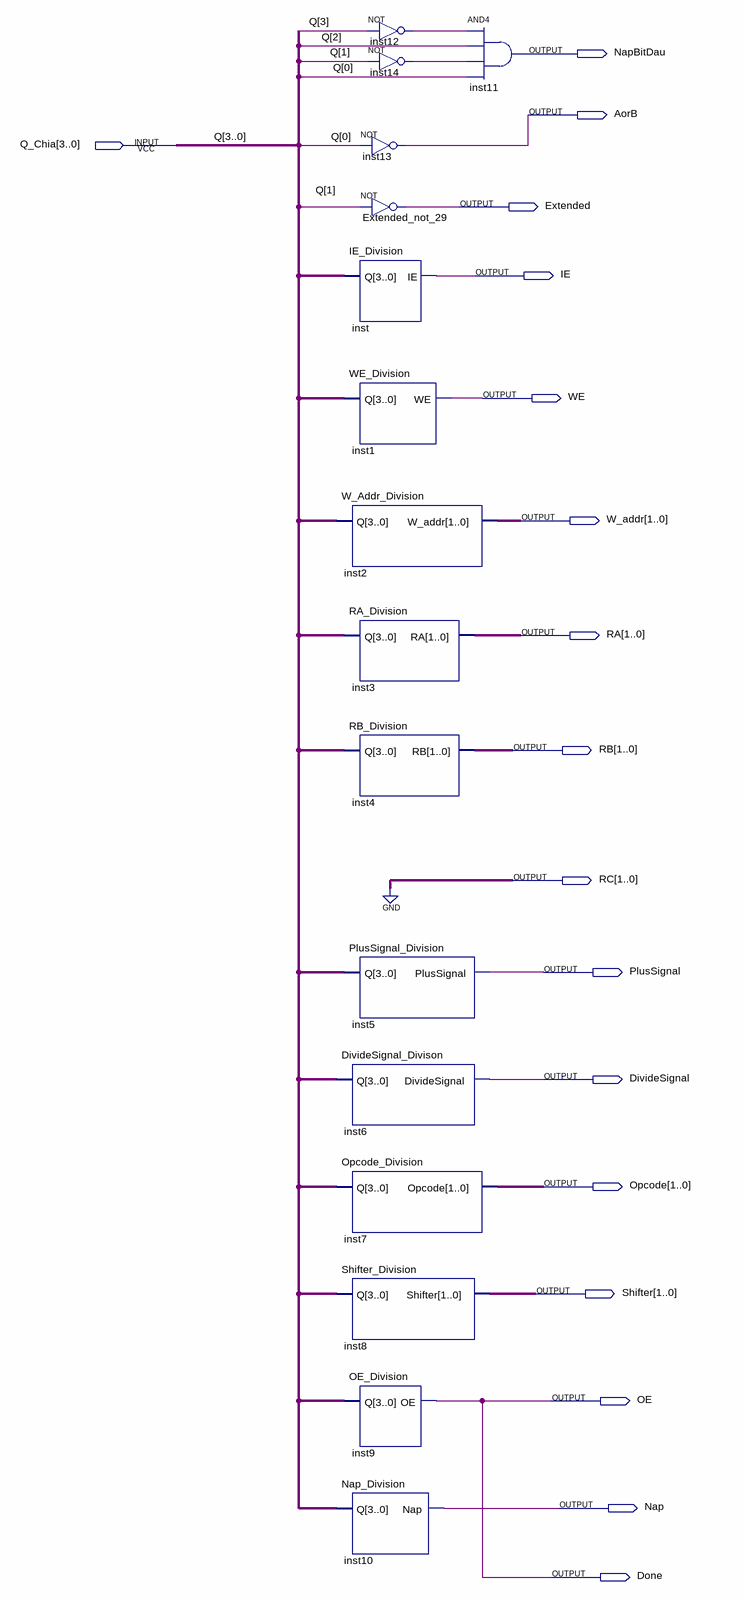
[diagram p0: schematic sheet]
// Quartus schematic DauRaTTChia.bdf as structural Verilog: 16 symbols, 17 pins
module DauRaTTChia (
  input  [3:0] Q_Chia,
  output NapBitDau,
  output AorB,
  output Extended,
  output IE,
  output WE,
  output [1:0] W_addr,
  output [1:0] RA,
  output [1:0] RB,
  output [1:0] RC,
  output PlusSignal,
  output DivideSignal,
  output [1:0] Opcode,
  output [1:0] Shifter,
  output OE,
  output Nap,
  output Done
);

  wire inst12_out, inst14_out;

  not inst12 (inst12_out, Q_Chia[3]);
  not inst14 (inst14_out, Q_Chia[1]);
  not inst13 (AorB, Q_Chia[0]);
  not Extended_not_29 (Extended, Q_Chia[1]);
  IE_Division inst (.Q(Q_Chia), .IE(IE));
  WE_Division inst1 (.Q(Q_Chia), .WE(WE));
  W_Addr_Division inst2 (.Q(Q_Chia), .W_addr(W_addr));
  RA_Division inst3 (.Q(Q_Chia), .RA(RA));
  RB_Division inst4 (.Q(Q_Chia), .RB(RB));
  PlusSignal_Division inst5 (.Q(Q_Chia), .PlusSignal(PlusSignal));
  DivideSignal_Divison inst6 (.Q(Q_Chia), .DivideSignal(DivideSignal));
  Opcode_Division inst7 (.Q(Q_Chia), .Opcode(Opcode));
  Shifter_Division inst8 (.Q(Q_Chia), .Shifter(Shifter));
  OE_Division inst9 (.Q(Q_Chia), .OE(Done));
  Nap_Division inst10 (.Q(Q_Chia), .Nap(Nap));
  and inst11 (NapBitDau, inst12_out, Q_Chia[2], inst14_out, Q_Chia[0]);

  assign OE = Done;
  assign RC = 2'b00;

  // Other names for the same wires on the sheet: Q[3:0] = Q_Chia
endmodule
